# EAGLE design untitled (EAGLE 9.4.2)
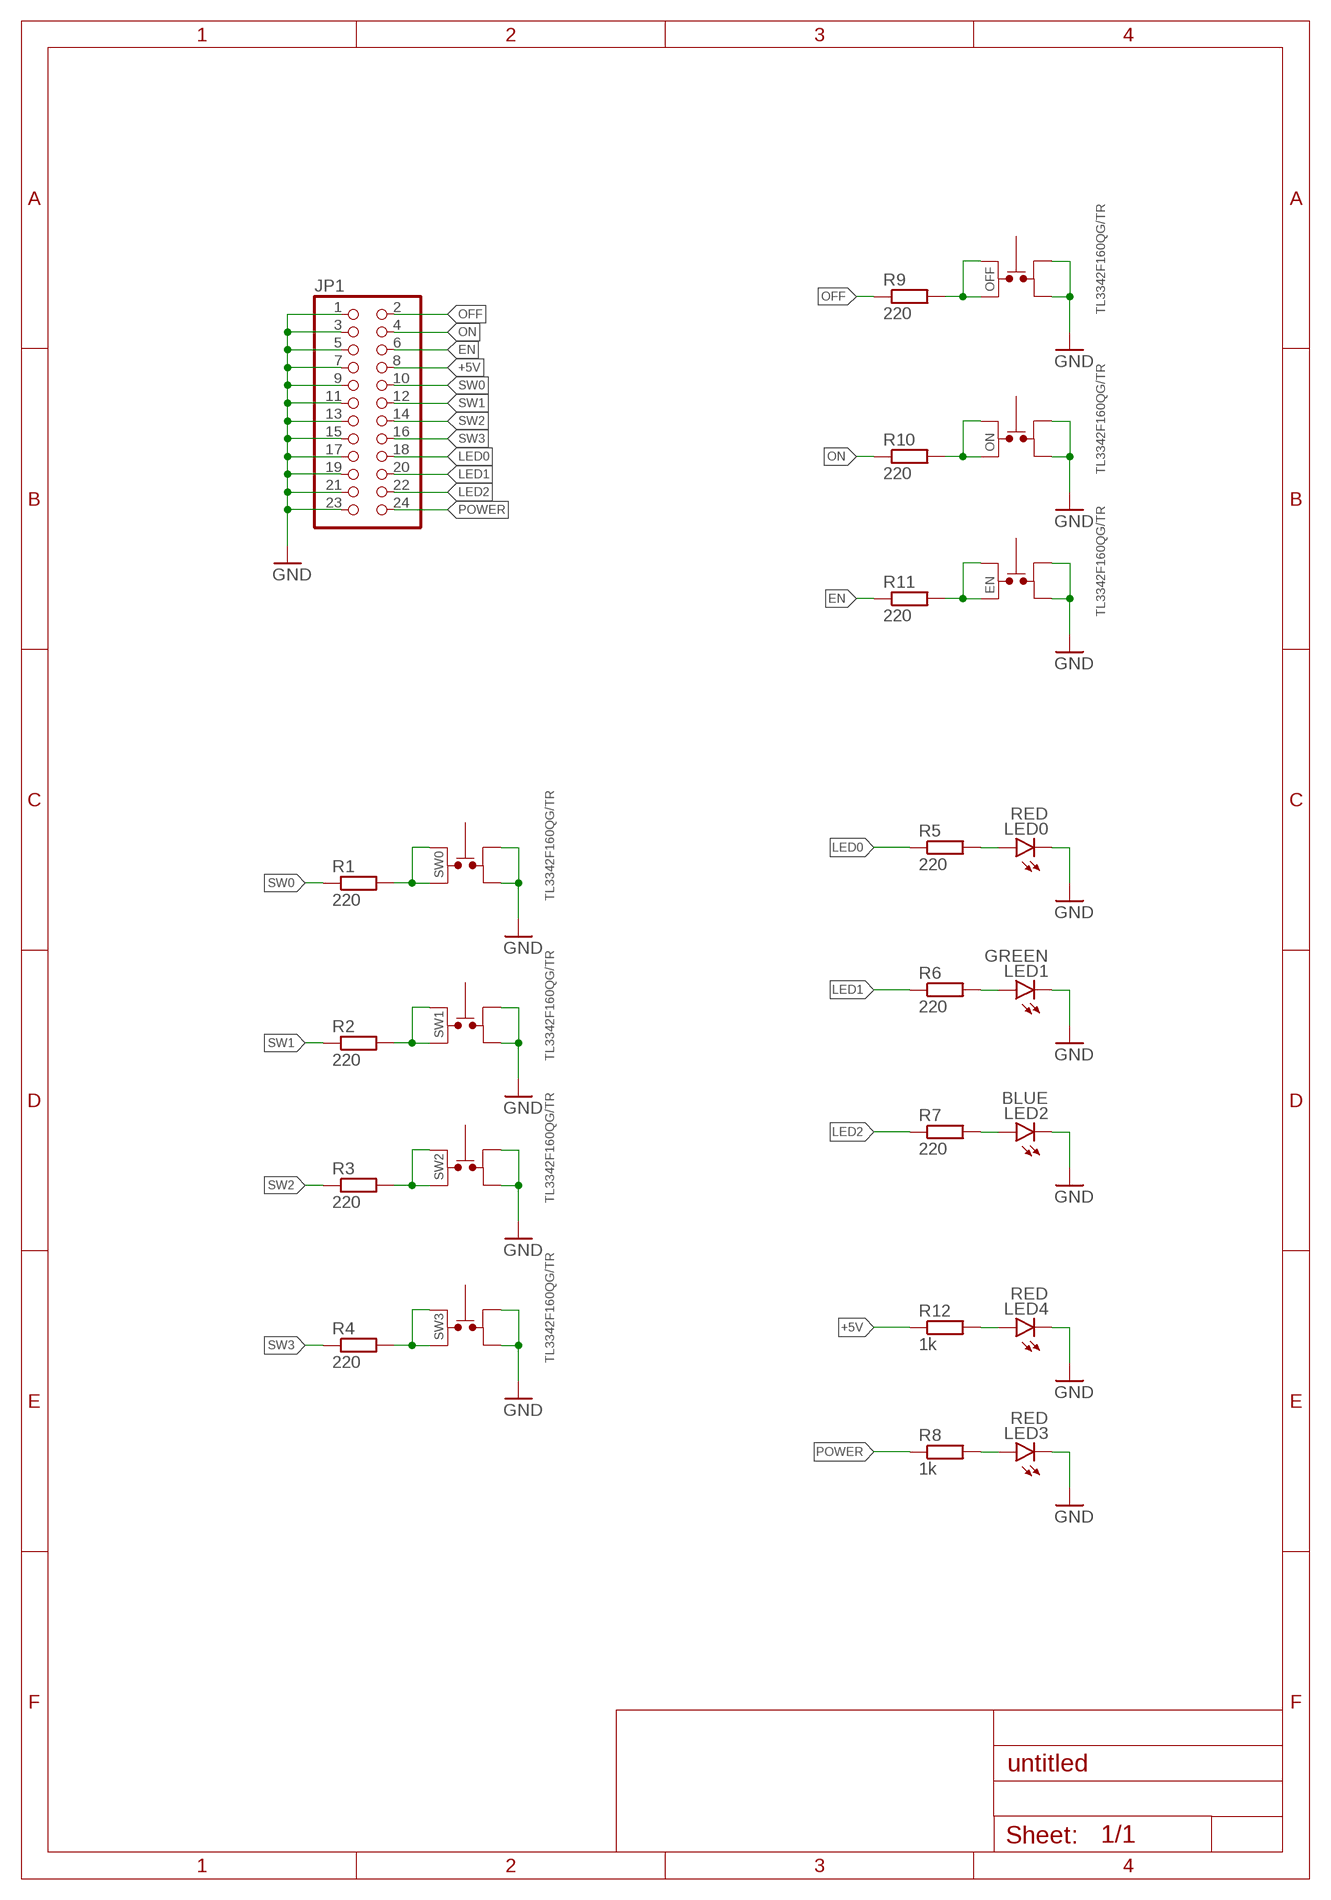
[diagram p0: schematic, sheet 1]

## Parts
EN  TL3342F160QG/TR  [TL3342F160QG/TR]
JP1  PINHD-2X12  [2X12]
LED0  RED  LEDSML0603  [SML0603]
LED1  GREEN  LEDSML0603  [SML0603]
LED2  BLUE  LEDSML0603  [SML0603]
LED3  RED  LEDSML0603  [SML0603]
LED4  RED  LEDSML0603  [SML0603]
OFF  TL3342F160QG/TR  [TL3342F160QG/TR]
ON  TL3342F160QG/TR  [TL3342F160QG/TR]
R1  220  R-EU_R0402  [R0402]
R2  220  R-EU_R0402  [R0402]
R3  220  R-EU_R0402  [R0402]
R4  220  R-EU_R0402  [R0402]
R5  220  R-EU_R0402  [R0402]
R6  220  R-EU_R0402  [R0402]
R7  220  R-EU_R0402  [R0402]
R8  1k  R-EU_R0402  [R0402]
R9  220  R-EU_R0402  [R0402]
R10  220  R-EU_R0402  [R0402]
R11  220  R-EU_R0402  [R0402]
R12  1k  R-EU_R0402  [R0402]
SW0  TL3342F160QG/TR  [TL3342F160QG/TR]
SW1  TL3342F160QG/TR  [TL3342F160QG/TR]
SW2  TL3342F160QG/TR  [TL3342F160QG/TR]
SW3  TL3342F160QG/TR  [TL3342F160QG/TR]

## Nets
+5V: JP1.8 R12.1
EN: JP1.6 R11.1
GND: EN.1 EN.2 JP1.1 JP1.3 JP1.5 JP1.7 JP1.9 JP1.11 JP1.13 JP1.15 JP1.17 JP1.19 JP1.21 JP1.23 LED0.C LED1.C LED2.C LED3.C LED4.C OFF.1 OFF.2 ON.1 ON.2 SW0.1 SW0.2 SW1.1 SW1.2 SW2.1 SW2.2 SW3.1 SW3.2
LED0: JP1.18 R5.1
LED1: JP1.20 R6.1
LED2: JP1.22 R7.1
N$1: R1.2 SW0.3 SW0.4
N$2: R2.2 SW1.3 SW1.4
N$3: R3.2 SW2.3 SW2.4
N$4: R4.2 SW3.3 SW3.4
N$5: LED0.A R5.2
N$6: LED1.A R6.2
N$7: LED2.A R7.2
N$8: LED3.A R8.2
N$9: OFF.3 OFF.4 R9.2
N$10: ON.3 ON.4 R10.2
N$11: EN.3 EN.4 R11.2
N$12: LED4.A R12.2
OFF: JP1.2 R9.1
ON: JP1.4 R10.1
POWER: JP1.24 R8.1
SW0: JP1.10 R1.1
SW1: JP1.12 R2.1
SW2: JP1.14 R3.1
SW3: JP1.16 R4.1

## Library data of the parts
EN OFF ON SW0 SW1-SW3 = Switch:TL3342F160QG/TR: SWITCH TACTILE SPST-NO 0.05A 12V Manufacturer's datasheet <http://spec_sheets.e-switch.com/specs/P010632.pdf>; CREATED_BY: PCBLayout.com; DIGI_KEY_PART_NUMBER: EG2531CT-ND; MANUFACTURER: E-Switch; MPN: TL3342F160QG/TR; PACKAGE: SPST_NO
JP1 = pinhead:PINHD-2X12: PIN HEADER
LED0 LED1-LED4 = led:LED: LED OSRAM: - CHIPLED LG R971, LG N971, LY N971, LG Q971, LY Q971, LO R971, LY R971 LH N974, LH R974 LS Q976, LO Q976, LY Q976 LO Q996 - Hyper CHIPLED LW Q18S LB Q993, LB Q99A, LB R99A - SideLED LS A670, LO A670, LY A670, LG A670, LP A670 LB A673, LV A673, LT A673, LW A673 LH A674 LY A675 LS A676, LA A676, LO A676, LY A676, LW A676 LS A679, LY A679, LG A679 - Hyper Micro SIDELED® LS Y876, LA Y876, LO Y876, LY Y876 LT Y87S - SmartLED LW L88C, LW L88S LB L89C, LB L89S, LG L890 LS L89K, LO L89K, LY L89K LS L896, LA L896, LO L896, LY L896 - TOPLED LS T670, LO T670, LY T670, LG T670, LP T670 LSG T670, LSP T670, LSY T670, LOP T670, LYG T670 LG T671, LOG T671, LSG T671 LB T673, LV T673, LT T673, LW T673 LH T674 LS T676, LA T676, LO T676, LY T676, LB T676, LH T676, LSB T676, LW T676 LB T67C, LV T67C, LT T67C, LS T67K, LO T67K, LY T67K, LW E67C LS E67B, LA E67B, LO E67B, LY E67B, LB E67C, LV E67C, LT E67C LW T67C LS T679, LY T679, LG T679 LS T770, LO T770, LY T770, LG T770, LP T770 LB T773, LV T773, LT T773, LW T773 LH T774 LS E675, LA E675, LY E675, LS T675 LS T776, LA T776, LO T776, LY T776, LB T776 LHGB T686 LT T68C, LB T68C - Hyper Mini TOPLED® LB M676 - Mini TOPLED Santana® LG M470 LS M47K, LO M47K, LY M47K Source: http://www.osram.convergy.de LUXEON: - LUMILED® LXK2-PW12-R00, LXK2-PW12-S00, LXK2-PW14-U00, LXK2-PW14-V00 LXK2-PM12-R00, LXK2-PM12-S00, LXK2-PM14-U00 LXK2-PE12-Q00, LXK2-PE12-R00, LXK2-PE12-S00, LXK2-PE14-T00, LXK2-PE14-U00 LXK2-PB12-K00, LXK2-PB12-L00, LXK2-PB12-M00, LXK2-PB14-N00, LXK2-PB14-P00, LXK2-PB14-Q00 LXK2-PR12-L00, LXK2-PR12-M00, LXK2-PR14-Q00, LXK2-PR14-R00 LXK2-PD12-Q00, LXK2-PD12-R00, LXK2-PD12-S00 LXK2-PH12-R00, LXK2-PH12-S00 LXK2-PL12-P00, LXK2-PL12-Q00, LXK2-PL12-R00 Source: www.luxeon.com KINGBRIGHT: KA-3528ASYC Source: www.kingbright.com
R1-R12 = rcl:R-EU_: RESISTOR, European symbol; SPICEPREFIX: R

## Board
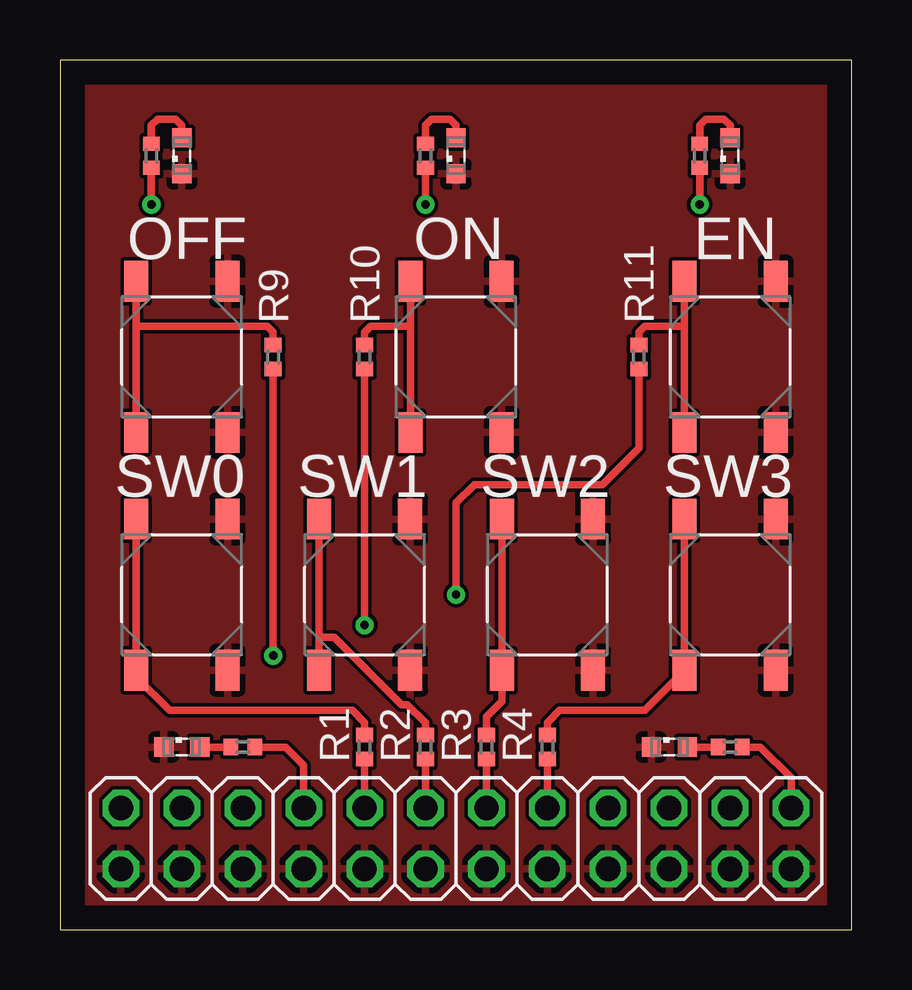
[diagram p1: board, top side]
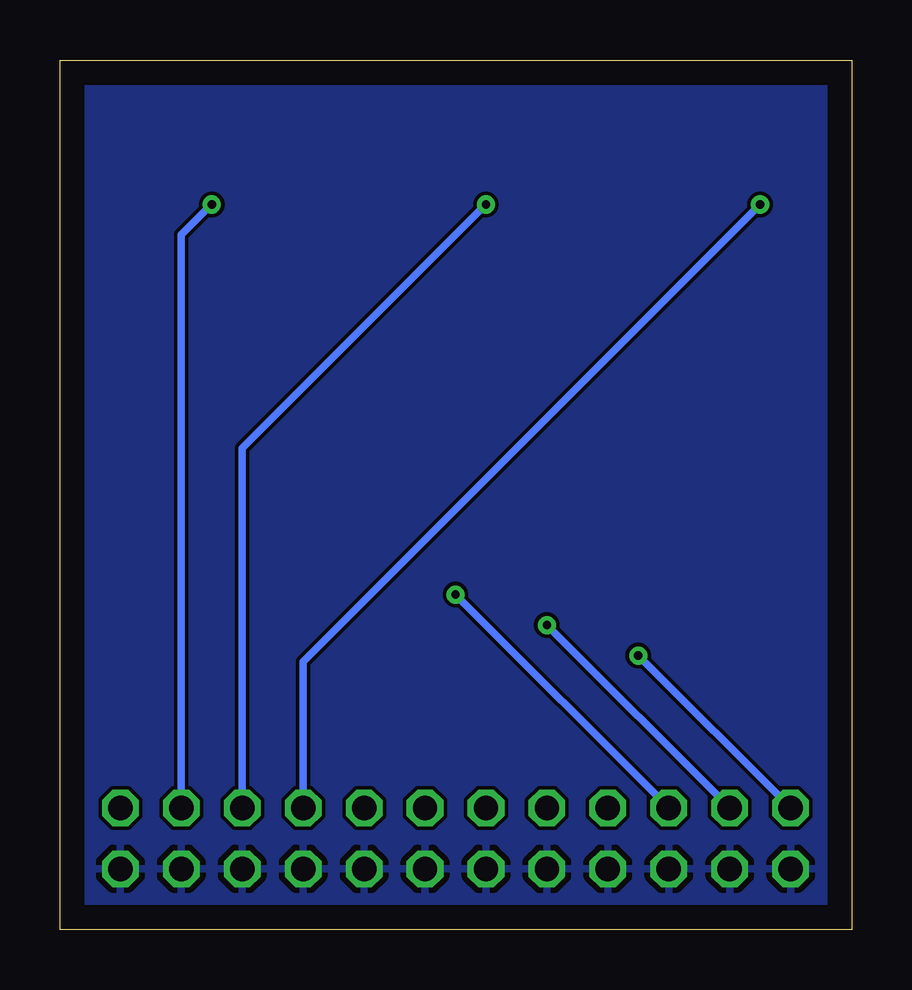
[diagram p2: board, bottom side, seen from below]

Size 33 x 36.25 mm. Coordinates in mm from the lower left corner, seen from the top.
Outline: 0,0 33,0 33,36.25 0,36.25 0,0
Copper layers (1*16): Top 0.035mm / dielectric 1.5mm / Bottom 0.035mm
Design rules "default": minimum track width 6mil, minimum drill 0.35mm, track to track 6mil, track to pad 6mil, pad to pad 6mil, via to via 6mil, smd to smd 6mil, copper to edge 40mil, drill to drill 6mil, minimum pad ring 10mil, minimum via ring 8mil, stop-mask expansion 4mil, vias tented up to drill 0mil, thermal gap 10mil

### Footprints (pad centres in the part's own frame; a part is rotated, then mirrored left to right if it is on the bottom)
TL3342F160QG/TR = smd 1.7 x 1: 1 -3.15,-1.9; 2 3.15,-1.9; 3 -3.15,1.9; 4 3.15,1.9
2X12 = drill 1.016 octagon: 1 -13.97,-1.27; 2 -13.97,1.27; 3 -11.43,-1.27; 4 -11.43,1.27; 5 -8.89,-1.27; 6 -8.89,1.27; 7 -6.35,-1.27; 8 -6.35,1.27; 9 -3.81,-1.27; 10 -3.81,1.27; 11 -1.27,-1.27; 12 -1.27,1.27; 13 1.27,-1.27; 14 1.27,1.27; 15 3.81,-1.27; 16 3.81,1.27; 17 6.35,-1.27; 18 6.35,1.27; 19 8.89,-1.27; 20 8.89,1.27; 21 11.43,-1.27; 22 11.43,1.27; 23 13.97,-1.27; 24 13.97,1.27
SML0603 = smd 0.8 x 0.8: A 0.75,0; C -0.75,0
R0402 = smd 0.6 x 0.7: 1 -0.5,0; 2 0.5,0

### Placement (x,y rotation side)
EN  27.94,23.88 90 top
JP1  16.51,3.81 0 top
LED0  5.08,32.26 90 top
LED1  16.51,32.26 90 top
LED2  27.94,32.26 90 top
LED3  25.4,7.62 0 top
LED4  5.08,7.62 0 top
OFF  5.08,23.88 90 top
ON  16.51,23.88 90 top
R1  12.7,7.62 90 top
R2  15.24,7.62 90 top
R3  17.78,7.62 90 top
R4  20.32,7.62 90 top
R5  3.81,32.26 90 top
R6  15.24,32.26 90 top
R7  26.67,32.26 90 top
R8  27.94,7.62 180 top
R9  8.89,23.88 90 top
R10  12.7,23.88 90 top
R11  24.13,23.88 90 top
R12  7.62,7.62 180 top
SW0  5.08,13.97 90 top
SW1  12.7,13.97 90 top
SW2  20.32,13.97 90 top
SW3  27.94,13.97 90 top

### Tracks (layer width: path | path; a pad name or v marks a point on that pad's centre or on a via)
+5V
  Top 0.305: R12.1 9.4,7.62 10.16,6.86 JP1.8
EN  (via drill 0.35)
  Top 0.305: R11.1 24.13,20.07 22.61,18.55 17.27,18.55 16.51,17.79 v16.51,13.97
  Bottom 0.305: v16.51,13.97 JP1.6
GND
  pour Top: -2.54,40.64 -2.54,-2.54 35.56,-2.54 35.56,40.64
  pour Bottom: -5.08,43.18 -5.08,-5.08 38.1,-5.08 38.1,43.18
LED0  (via drill 0.35)
  Top 0.305: v3.81,30.23 R5.1
  Bottom 0.305: JP1.18 22.86,11.18 v3.81,30.23
LED1  (via drill 0.35)
  Top 0.305: v15.24,30.23 R6.1
  Bottom 0.305: JP1.20 25.4,20.07 v15.24,30.23
LED2  (via drill 0.35)
  Top 0.305: v26.67,30.23 R7.1
  Bottom 0.305: JP1.22 27.94,28.96 v26.67,30.23
N$1
  Top 0.305: SW0.4 SW0.3 3.18,10.54 4.57,9.14 12.19,9.14 12.7,8.64 R1.2
N$2
  Top 0.305: SW1.3 10.8,12.19 | 10.8,12.19 SW1.4 | R2.2 15.24,8.63 14.48,9.39 14.23,9.39 11.43,12.19 10.8,12.19
N$3
  Top 0.305: SW2.4 SW2.3 18.42,9.53 17.78,8.89 R3.2
N$4
  Top 0.305: SW3.4 SW3.3 26.04,10.8 24.38,9.14 20.83,9.14 20.32,8.64 R4.2
N$5
  Top 0.305: R5.2 3.81,33.53 4.06,33.78 4.83,33.78 5.08,33.53 LED0.A
N$6
  Top 0.305: R6.2 15.24,33.53 15.49,33.78 16.26,33.78 16.51,33.53 LED1.A
N$7
  Top 0.305: R7.2 26.67,33.53 26.92,33.78 27.69,33.78 27.94,33.53 LED2.A
N$8
  Top 0.305: R8.2 LED3.A
N$9
  Top 0.305: OFF.3 3.18,25.15 | 3.18,25.15 OFF.4 | R9.2 8.89,24.89 8.64,25.15 3.18,25.15
N$10
  Top 0.305: ON.4 14.61,25.15 | 14.61,25.15 ON.3 | R10.2 12.7,24.89 12.95,25.15 14.61,25.15
N$11
  Top 0.305: EN.4 26.04,25.15 | 26.04,25.15 EN.3 | R11.2 24.13,24.89 24.38,25.15 26.04,25.15
N$12
  Top 0.305: LED4.A R12.2
OFF  (via drill 0.35)
  Top 0.305: v8.89,11.43 R9.1
  Bottom 0.305: JP1.2 v8.89,11.43
ON  (via drill 0.35)
  Top 0.305: v12.7,12.7 R10.1
  Bottom 0.305: v12.7,12.7 JP1.4
POWER
  Top 0.305: JP1.24 30.48,6.34 29.2,7.62 R8.1
SW0
  Top 0.305: JP1.10 R1.1
SW1
  Top 0.305: R2.1 JP1.12
SW2
  Top 0.305: JP1.14 R3.1
SW3
  Top 0.305: R4.1 JP1.16